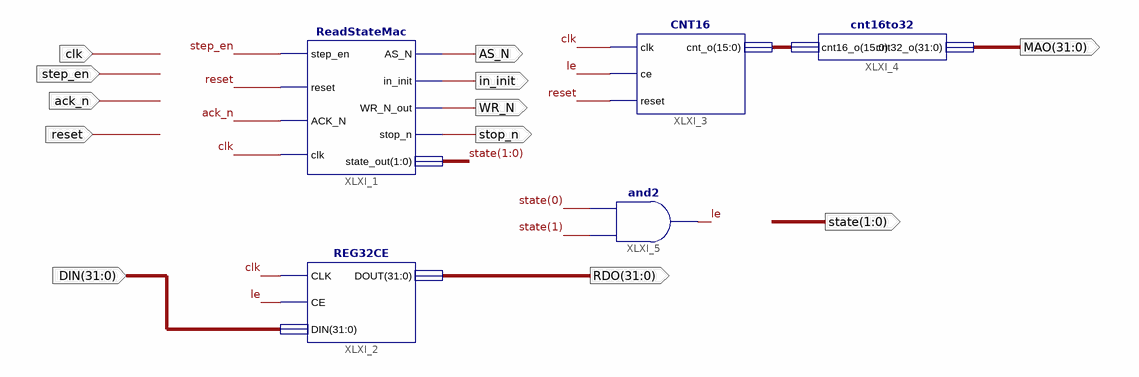
[diagram p0: schematic sheet 1]
// Xilinx ISE schematic ReadMachine.sch (spartan6) as structural Verilog: 5 symbols, 12 ports
module ReadMachine (
  input  step_en,
  input  ack_n,
  input  clk,
  input  reset,
  input  [31:0] DIN,
  output AS_N,
  output in_init,
  output WR_N,
  output stop_n,
  output [1:0] state,
  output [31:0] MAO,
  output [31:0] RDO
);

  wire le;
  wire [15:0] XLXN_32;

  ReadStateMac XLXI_1 (
    .step_en(step_en), .reset(reset), .ACK_N(ack_n), .clk(clk), .AS_N(AS_N), .in_init(in_init),
    .WR_N_out(WR_N), .stop_n(stop_n), .state_out(state));
  REG32CE XLXI_2 (.CLK(clk), .CE(le), .DIN(DIN), .DOUT(RDO));
  and XLXI_5 (le, state[1], state[0]);
  CNT16 XLXI_3 (.clk(clk), .ce(le), .reset(reset), .cnt_o(XLXN_32));
  cnt16to32 XLXI_4 (.cnt16_o(XLXN_32), .cnt32_o(MAO));
endmodule
